# EasyEDA Pro project ProProject_STM32F1_TEMP_2024-12-15.epro

# Schematic Schematic1_1
Create Date: 2024-12-01; Page Name: P1; Project Name: STM32F1_TEMP; Schematic Name: Schematic1_1; Update Date: 2024-12-01; Company: 嘉立创EDA; Page Size: A4; Version: V1.0
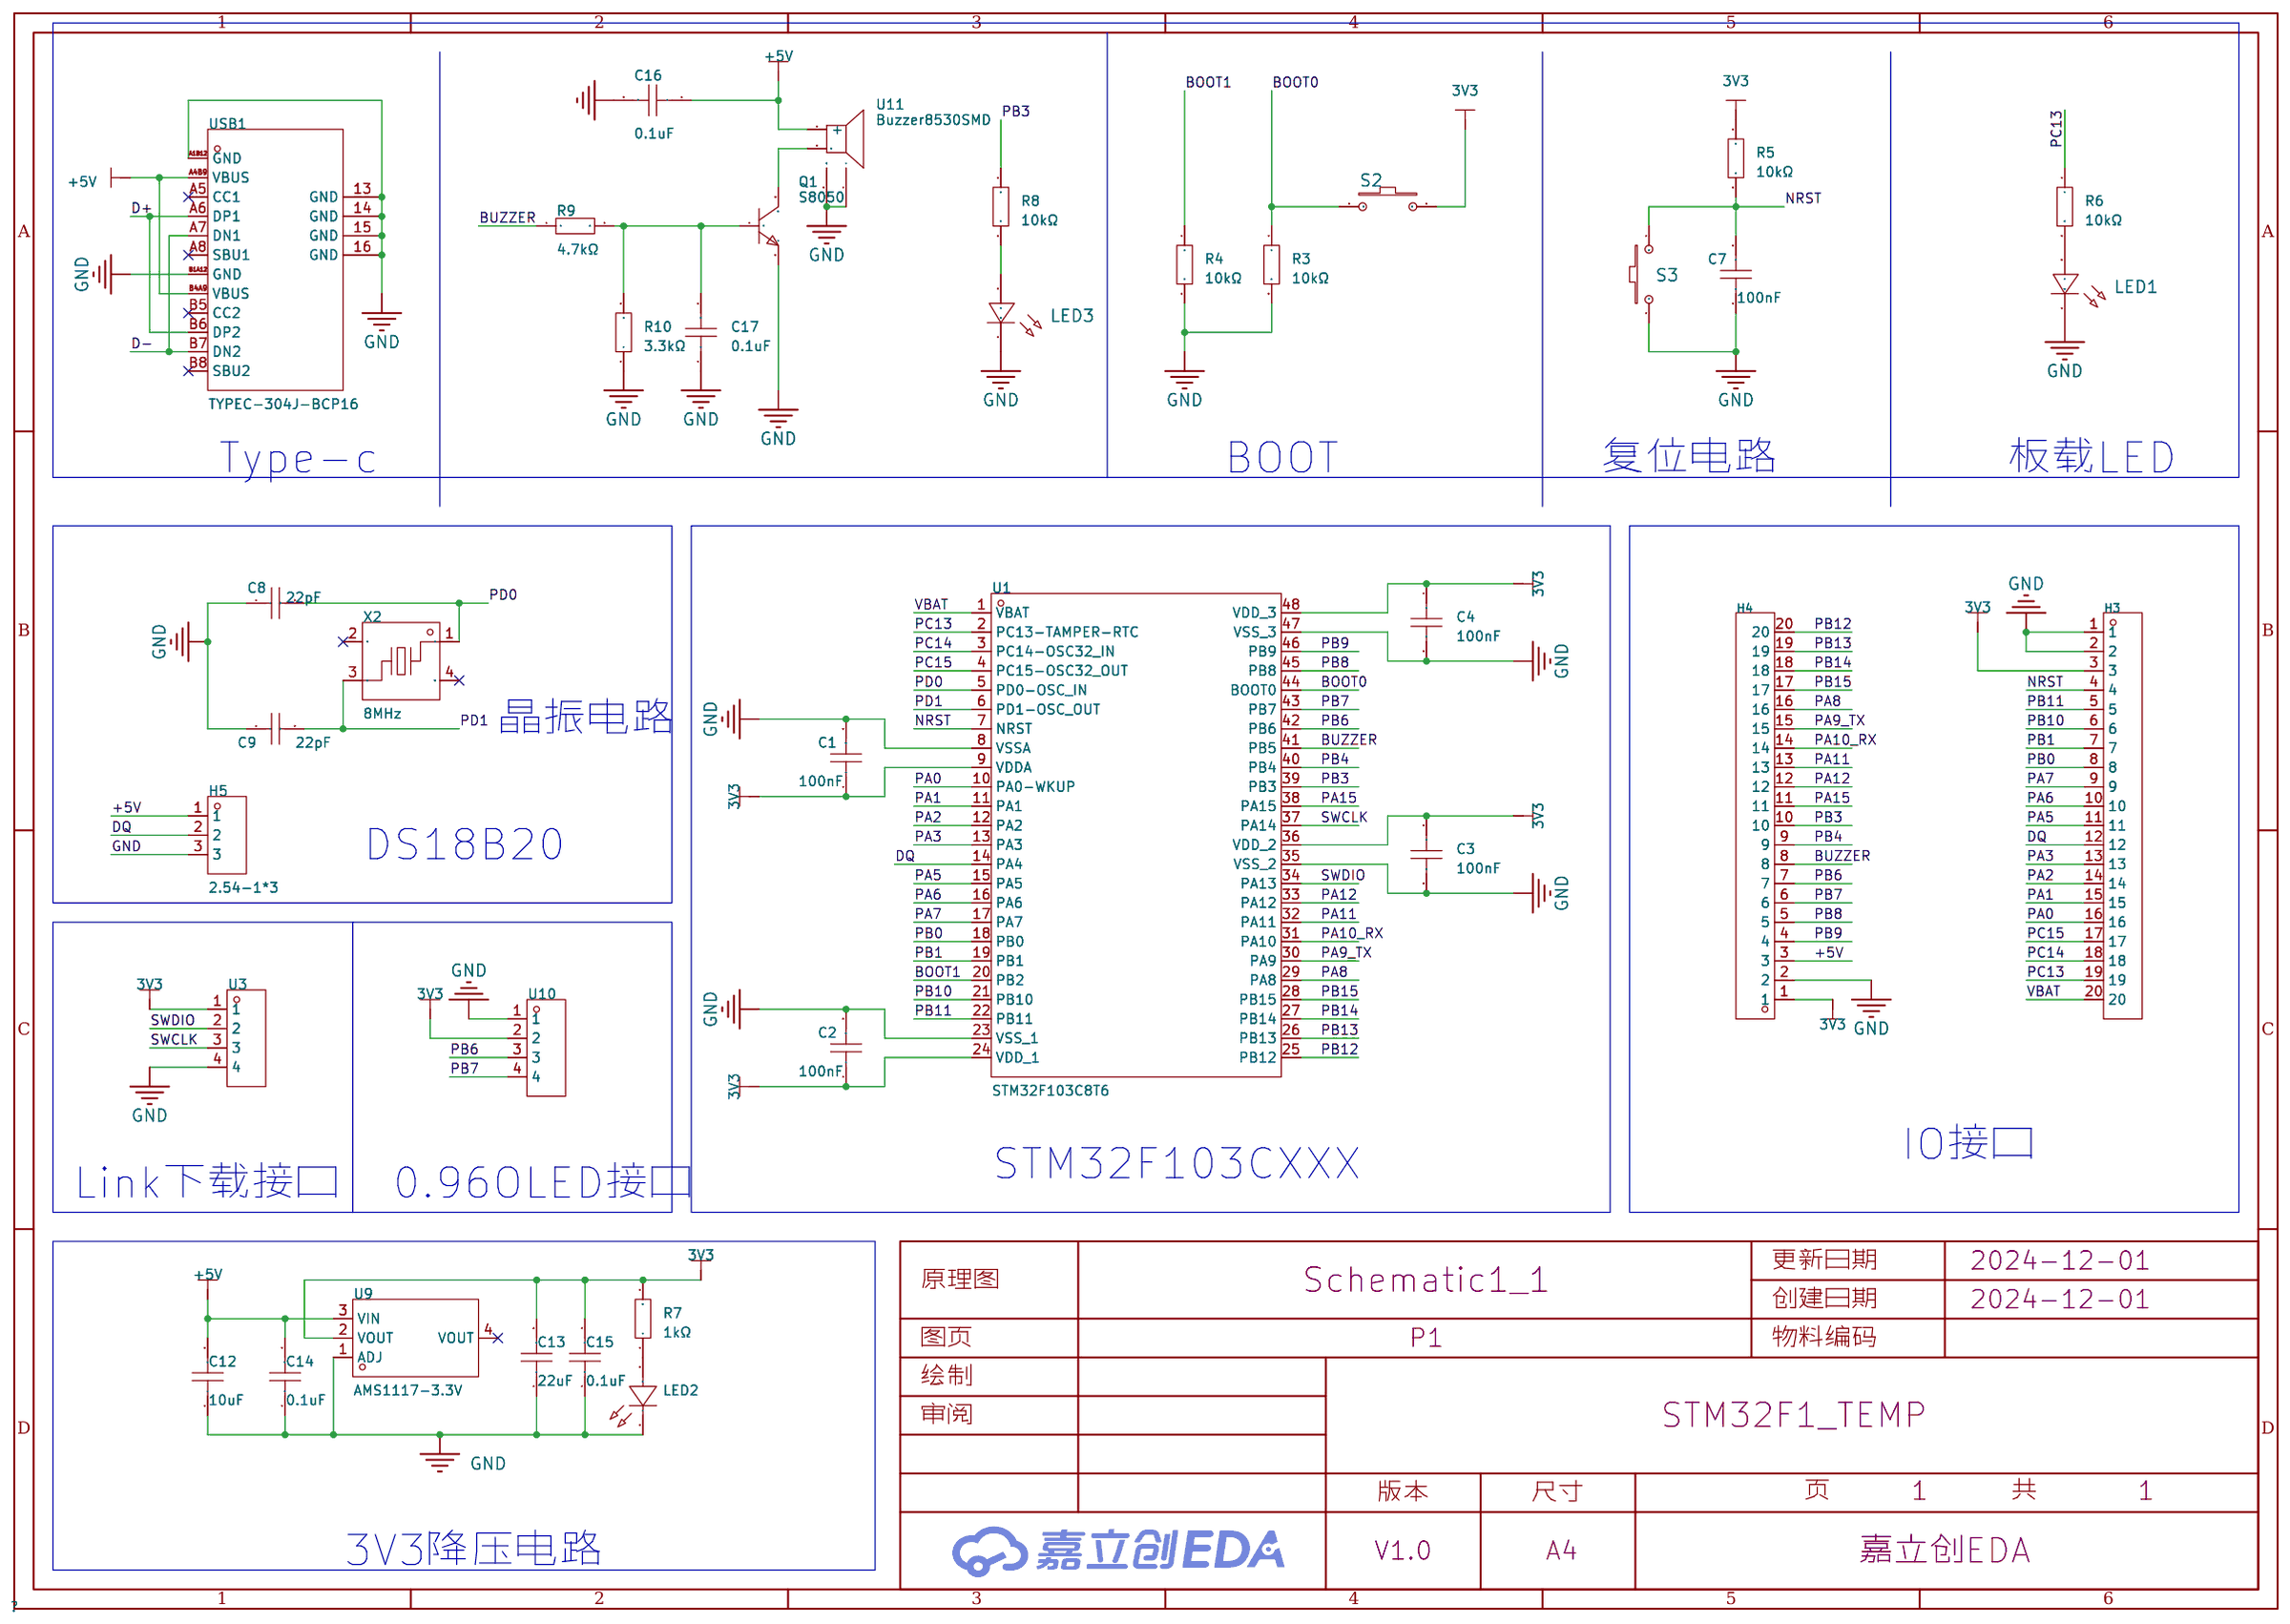
[diagram p0: schematic sheet]

## Parts
C1  100nF  [C0603]
C2  100nF  [C0603]
C3  100nF  [C0603]
C4  100nF  [C0603]
C7  100nF  [C0603]
C8  22pF  [C0603]
C9  22pF  [C0603]
C12  10uF  [C0603]
C13  22uF  [C0603]
C14  0.1uF  [C0603]
C15  0.1uF  [C0603]
C16  0.1uF  [C0603]
C17  0.1uF  [C0603]
H3  PZ254-1-20-Z-8.5  [HDR-TH_20P-P2.54-V-M]
H4  PZ254-1-20-Z-8.5  [HDR-TH_20P-P2.54-V-M]
H5  2.54-1*3  [HDR-TH_3P-P2.54-V-M-1]
LED1  -  [LED_0603]
LED2  -  [LED0805-RD_BLUE]
LED3  -  [LED_0603]
Q1  S8050  [SOT-23-3_L2.9-W1.3-P1.90-LS2.4-BR]
R3  10kΩ  [R0603]
R4  10kΩ  [R0603]
R5  10kΩ  [R0603]
R6  10kΩ  [R0603]
R7  1kΩ  [R0603]
R8  10kΩ  [R0603]
R9  4.7kΩ  [R0603]
R10  3.3kΩ  [R0603]
S2  按键-2Pin  [BUTTON_ALPS]
S3  按键-2Pin  [BUTTON_ALPS]
U1  STM32F103C8T6  [LQFP-48_L7.0-W7.0-P0.50-LS9.0-BL]
U3  XDZ254-1-04-Z-2.5-G1  [HDR-TH_4P-P2.54-V-M]
U9  AMS1117-3.3V  [SOT-223-4_L6.5-W3.5-P2.30-LS7.0-BR]
U10  XDZ254-1-04-Z-2.5-G1  [HDR-TH_4P-P2.54-V-M]
U11  Buzzer8530SMD  [BUZ-SMD_4P-L8.5-W8.5-P8.50-TL]
USB1  TYPEC-304J-BCP16  [USB-C-SMD_TYPEC-304J-BCP16]
X2  8MHz  [CRYSTAL-SMD_4P-L3.2-W2.5-BL]

## Library data of the parts
C1-C4 C7 = CC0603KRX7R9BB104: 容值:100nF;精度:±10%;额定电压:50V;材质(温度系数):X7R;; LCSC Part Name: 100nF ±10% 50V; Supplier Part: C14663; Manufacturer: YAGEO(国巨); Supplier Footprint: 0603; JLCPCB Part Class: 基础库; Datasheet: https://atta.szlcsc.com/upload/public/pdf/source/20180910/C282072_33301C7F631E79921B82A8DAC6BCC5B3.pdf; Supplier: LCSC; Tolerance: ±10%; Voltage Rated: 50V; Temperature Coefficient: X7R
C8 C9 = CC0603JRNPO9BN220: 容值:22pF;精度:±5%;额定电压:50V;材质(温度系数):NP0;; LCSC Part Name: 22pF ±5% 50V; Supplier Part: C105620; Manufacturer: YAGEO(国巨); Supplier Footprint: 0603; JLCPCB Part Class: 扩展库; Datasheet: https://atta.szlcsc.com/upload/public/pdf/source/20170505/1493957838062.pdf; Supplier: LCSC; Tolerance: ±5%; Voltage Rated: 50V; Temperature Coefficient: NP0
C12-C17 = CAP_0603: Supplier Footprint: 0603
H3 H4 = PZ254-1-20-Z-8.5_C2894943: 排数:单排;总PIN位数:20P;间距:2.54mm;插针结构:1x20P;行距:-;安装类型:直插;圆针/方针:方针;额定电流:3A;额定电压:-;配合针长度:6mm;塑高:2.5mm;端接针长度:3mm;触头材质:-;工作温度范围:-40℃~+105℃;颜色:黑色;; LCSC Part Name: 2.54mm 1x20P 直插 方针; Supplier Part: C2894943; Manufacturer: HCTL(华灿天禄); Supplier Footprint: 插件,P=2.54mm; JLCPCB Part Class: 扩展库; Datasheet: https://atta.szlcsc.com/upload/public/pdf/source/20230609/805D25CEF03592837AF6F506EEB5ED41.pdf; Supplier: LCSC; Number of Rows: 单排; Number of Pins: 20P; Pitch: 2.54mm; Pin Structure: 1x20P; Mounting Type: 直插; Circluar Pins/Square Pins: 方针; Current Rating (Max): 3A; Length of Mating Pin: 6mm; Insulation Height: 2.5mm; Length of End Connection Pin: 3mm; Operating Temperature Range: -40℃~+105℃; Color: 黑色
H5 = 2.54-1*3: 插针结构:1x3P;间距:2.54mm;排数:单排;总PIN位数:3P;触头镀层:金;; LCSC Part Name: 停产; Supplier Part: C5116482; Manufacturer: ZHOURI(洲日); Supplier Footprint: 插件,P=2.54mm; JLCPCB Part Class: 扩展库; Datasheet: https://atta.szlcsc.com/upload/public/pdf/source/20220729/4DB71EF9013296CFACD97372BAB8A1F0.pdf; Supplier: LCSC; Pin Structure: 1x3P; Pitch: 2.54mm; Number of Rows: 单排; Number of Pins: 3P; Contact Plating: 金
LED1 LED3 = LED_0603-R: Supplier Footprint: 0603
LED2 = RF-BGB170TS-CB-E0: 发光颜色:蓝灯;二极管配置:-;透镜颜色:-;主波长:-;峰值波长:-;色温:-;光通量(25时):-;测试电流:20mA;正向电压(VF):-;发光强度:-;功率:70mW;发光角度:140°;安装方式:正贴;工作温度:-40~+85;; LCSC Part Name: 蓝灯 正贴; Supplier Part: C2908306; Manufacturer: Refond(瑞丰); Supplier Footprint: 0805; JLCPCB Part Class: Extended Part; Datasheet: https://atta.szlcsc.com/upload/public/pdf/source/20211101/C871A18E9B6E101B84BDF0C661245F86.pdf; Supplier: LCSC; Emitted Color: 蓝灯; Forward Current: 20mA; Power Dissipation: 70mW; Viewing Angle: 140°; Mounting Sytle: 正贴; Operating Temperature: -40~+85
Q1 = S8050: NPN 25V 500mA 120-400 SOT-23; Supplier Part: C2931719; Manufacturer: Doeshare(德芯); Supplier Footprint: SOT-23; JLCPCB Part Class: 扩展库; Datasheet: https://atta.szlcsc.com/upload/public/pdf/source/20220117/E6D3315E0D6ADDB25840BFFAC039C5C0.pdf; Supplier: LCSC
R3-R6 R8 = 0603WAF1002T5E: 电阻类型:厚膜电阻;阻值:10kΩ;精度:±1%;功率:100mW;温度系数:±100ppm/;最大工作电压:75V;工作温度范围:-55~+155;; LCSC Part Name: 10kΩ ±1% 100mW; Supplier Part: C25804; Manufacturer: UNI-ROYAL(厚声); Supplier Footprint: 0603; JLCPCB Part Class: Basic Part; Datasheet: https://atta.szlcsc.com/upload/public/pdf/source/20200306/C422600_1E6D84923E4A46A82E41ADD87F860B5C.pdf; Supplier: LCSC; Type: 厚膜电阻; Tolerance: ±1%; Power(Watts): 100mW; Temperature Coefficient: ±100ppm/; Overload Voltage (Max): 75V; Operating Temperature Range: -55~+155
R7 = RS-05K102JT: 阻值:1kΩ;精度:±5%;功率:125mW;温度系数:±100ppm/;最大工作电压:150V;工作温度范围:-55~+155;; LCSC Part Name: 1kΩ ±5%; Supplier Part: C115302; Manufacturer: FH(风华); Supplier Footprint: 0805; JLCPCB Part Class: Extended Part; Datasheet: https://atta.szlcsc.com/upload/public/pdf/source/20170704/1499151304704.pdf; Supplier: LCSC; Tolerance: ±5%; Power(Watts): 125mW; Temperature Coefficient: ±100ppm/; Overload Voltage (Max): 150V; Operating Temperature Range: -55~+155
R9 = AECR0603F4K70K9: 电阻类型:厚膜电阻;阻值:4.7kΩ;精度:±1%;功率:100mW;最大工作电压:50V;温度系数:±100ppm/℃;; LCSC Part Name: 厚膜电阻 4.7kΩ ±1% 100mW; Supplier Part: C328364; Manufacturer: RESI(开步睿思); Supplier Footprint: 0603; JLCPCB Part Class: 扩展库; Datasheet: https://atta.szlcsc.com/upload/public/pdf/source/20181212/C352486_55819DC58ECB15BFA3B0F11121E3606D.pdf; Supplier: LCSC; Type: 厚膜电阻; Tolerance: ±1%; Power(Watts): 100mW; Overload Voltage (Max): 50V; Temperature Coefficient: ±100ppm/℃; Operating Temperature Range: -55℃~+155℃
R10 = 0603WAF3301T5E: 电阻类型:厚膜电阻;阻值:3.3kΩ;精度:±1%;功率:100mW;最大工作电压:75V;温度系数:±100ppm/℃;; LCSC Part Name: 3.3kΩ ±1% 100mW 厚膜电阻; Supplier Part: C22978; Manufacturer: UNI-ROYAL(厚声); Supplier Footprint: 0603; JLCPCB Part Class: 基础库; Datasheet: https://atta.szlcsc.com/upload/public/pdf/source/20200306/C422600_1E6D84923E4A46A82E41ADD87F860B5C.pdf; Supplier: LCSC; Type: 厚膜电阻; Tolerance: ±1%; Power(Watts): 100mW; Overload Voltage (Max): 75V; Temperature Coefficient: ±100ppm/℃; Operating Temperature Range: -55℃~+155℃
S2 S3 = 按键-2Pin: --Ƭ; Origin Footprint 2: SW-KEY1; LatestRevisionDate: 17-Jul-2002; LatestRevisionNote: Re-released for DXP Platform.; PackageReference: SPST-2; Published: 24-Mar-1999; Publisher: Altium Limited
U1 = STM32F103C8T6: CPU内核:ARM-M3;程序存储容量:64KB;RAM总容量:20KB;GPIO端口数量:37;工作电压范围:2V~3.6V;CPU最大主频:72MHz;程序存储器类型:FLASH;; Supplier Part: C8734; Manufacturer: ST(意法半导体); Supplier Footprint: LQFP-48(7x7); JLCPCB Part Class: 扩展库; Datasheet: https://atta.szlcsc.com/upload/public/pdf/source/20220812/8363ACEC51AD55ECEB84799464F7CB85.pdf; Supplier: LCSC; CPU Core: ARM-M3; Program Storage Size: 64KB; RAM Size: 20KB; GPIO Ports Number: 37; Operating Voltage Range: 2V~3.6V; CPU Maximum Speed: 72MHz; Program Memory Type: FLASH; Operating Temperature Range: -40℃~+85℃; ADC (Bit): 12bit; Universal Serial Bus: 有; Peripheral/Function: 看门狗；DMA；看门狗；温度传感器; Watchdog: 有; Infrared Data Association: 有; Low-Voltage Detect: 有; Direct Memory Access: 有; Internal Oscillator: 有
U3 U10 = XDZ254-1-04-Z-2.5-G1: 插针结构:1x4P;间距:2.54mm;圆针/方针:方针;安装类型:直插;排数:单排;总PIN位数:4P;额定电流:3A;配合针长度:6mm;塑高:2.5mm;端接针长度:3mm;工作温度范围:-40℃~+105℃;颜色:黑色;; LCSC Part Name: 间距:2.54mm 1x4P 直插 方针; Supplier Part: C18905845; Manufacturer: XUNDA(讯答); Supplier Footprint: 插件,P=2.54mm; Datasheet: https://atta.szlcsc.com/upload/public/pdf/source/20231019/B07AD669ED74A6E3E65E4CCF814A6B3E.pdf; Supplier: LCSC; Pin Structure: 1x4P; Pitch: 2.54mm; Circluar Pins/Square Pins: 方针; Mounting Type: 直插; Number of Rows: 单排; Number of Pins: 4P; Current Rating (Max): 3A; Length of Mating Pin: 6mm; Insulation Height: 2.5mm; Length of End Connection Pin: 3mm; Operating Temperature Range: -40℃~+105℃; Color: 黑色
U9 = REG1117A: Supplier Part: C2869046; Manufacturer: TI(德州仪器); Supplier Footprint: SOT-223-4; JLCPCB Part Class: Extended Part; Datasheet: https://atta.szlcsc.com/upload/public/pdf/source/20230221/F563D9394BFC1B9F42D11B54DC05EE53.pdf; Supplier: LCSC
U11 = Buzzer8530SMD: Supplier Part: C9900004191; Supplier Footprint: BuzzerMLT8530; JLCPCB Part Class: 扩展库; Supplier: LCSC
USB1 = TYPEC-304J-BCP16: 连接器类型:Type-C;标准:USB 3.1;公母:母;端口数量:1;触点数量:16P;安装方式:卧贴;额定电流 - 电源:5A;工作温度范围:-40℃~+85℃;焊接温度(最大值):260℃;; LCSC Part Name: Type-C 母 卧贴; Supplier Part: C2835315; Manufacturer: XUNPU(讯普); Supplier Footprint: SMD; JLCPCB Part Class: 扩展库; Datasheet: https://atta.szlcsc.com/upload/public/pdf/source/20210528/C2835315_A76BD3CF9329D12B6041421AD23BFD66.pdf; Supplier: LCSC; Connector Type: Type-C; Standard: USB 3.1; Gender: 母; Number of Ports: 1; Number of Contacts: 16P; Mounting Style: 卧贴; Current Rating - Power (Max): 5A; Operating Temperature Range: -40℃~+85℃; Soldering Temperature(Max): 260℃
X2 = X32258MSB4SI: 晶振类型:贴片晶振;频率:8MHz;常温频差:±10ppm;外接负载电容:20pF;频率稳定度(全温):±20ppm;; LCSC Part Name: 8MHz ±10ppm 20pF; Supplier Part: C2682774; Manufacturer: YXC(扬兴晶振); Supplier Footprint: SMD3225-4P; JLCPCB Part Class: 扩展库; Datasheet: https://atta.szlcsc.com/upload/public/pdf/source/20240329/19D5F850207469550BEB00D7DFEDBC7A.pdf; Supplier: LCSC; Crystal Type: 贴片晶振; Normal temperature Frequency Tolerance: ±10ppm; External load capacitor: 20pF; Frequency Stability(Full temperature range): ±20ppm; Operating Temperature: -40℃~+85℃

## Nets
3V3: C1.1 C2.1 C3.1 C4.1 C13.2 C15.2 H3.3 H4.1 R5.1 R7.2 S2.2 U1.9(VDDA) U1.24(VDD_1) U1.36(VDD_2) U1.48(VDD_3) U3.1 U9.2(VOUT) U10.2
+5V: C12.2 C14.2 C16.1 H4.3 H5.1 U9.3(VIN) U11.1(+) USB1.A4B9(VBUS) USB1.B4A9(VBUS)
GND: C1.2 C2.2 C3.2 C4.2 C7.1 C8.1 C9.1 C12.1 C13.1 C14.1 C15.1 C16.2 C17.1 H3.1 H3.2 H4.2 H5.3 LED1.1(C) LED2.1(K) LED3.1(C) Q1.2(E) R3.2 R4.2 R10.1 S3.1 U1.8(VSSA) U1.23(VSS_1) U1.35(VSS_2) U1.47(VSS_3) U3.4 U9.1(ADJ) U10.1 U11.3 U11.4 USB1.13(GND) USB1.14(GND) USB1.15(GND) USB1.16(GND) USB1.A1B12(GND) USB1.B1A12(GND)
VBAT: H3.20 U1.1(VBAT)
BOOT0: R3.1 S2.1 U1.44(BOOT0)
BOOT1: R4.1 U1.20(PB2)
BUZZER: H4.8 R9.1 U1.41(PB5)
D+: USB1.A6(DP1) USB1.B6(DP2)
D-: USB1.A7(DN1) USB1.B7(DN2)
DQ: H3.12 H5.2 U1.14(PA4)
NRST: C7.2 H3.4 R5.2 S3.2 U1.7(NRST)
PA0: H3.16 U1.10(PA0-WKUP)
PA1: H3.15 U1.11(PA1)
PA2: H3.14 U1.12(PA2)
PA3: H3.13 U1.13(PA3)
PA5: H3.11 U1.15(PA5)
PA6: H3.10 U1.16(PA6)
PA7: H3.9 U1.17(PA7)
PA8: H4.16 U1.29(PA8)
PA9_TX: H4.15 U1.30(PA9)
PA10_RX: H4.14 U1.31(PA10)
PA11: H4.13 U1.32(PA11)
PA12: H4.12 U1.33(PA12)
PA15: H4.11 U1.38(PA15)
PB0: H3.8 U1.18(PB0)
PB1: H3.7 U1.19(PB1)
PB3: H4.10 R8.1 U1.39(PB3)
PB4: H4.9 U1.40(PB4)
PB6: H4.7 U1.42(PB6) U10.3
PB7: H4.6 U1.43(PB7) U10.4
PB8: H4.5 U1.45(PB8)
PB9: H4.4 U1.46(PB9)
PB10: H3.6 U1.21(PB10)
PB11: H3.5 U1.22(PB11)
PB12: H4.20 U1.25(PB12)
PB13: H4.19 U1.26(PB13)
PB14: H4.18 U1.27(PB14)
PB15: H4.17 U1.28(PB15)
PC13: H3.19 R6.1 U1.2(PC13-TAMPER-RTC)
PC14: H3.18 U1.3(PC14-OSC32_IN)
PC15: H3.17 U1.4(PC15-OSC32_OUT)
PD0: C8.2 U1.5(PD0-OSC_IN) X2.1
PD1: C9.2 U1.6(PD1-OSC_OUT) X2.3
SWCLK: U1.37(PA14) U3.3
SWDIO: U1.34(PA13) U3.2
$1N2288: LED1.2(A) R6.2
$1N3114: LED2.2(A) R7.1
$1N7205: LED3.2(A) R8.2
$1N7342: Q1.3(C) U11.2
$1N7685: C17.2 Q1.1(B) R9.2 R10.2

Not connected (* = marked no-connect by the designer): U9 4(VOUT)*; USB1 A5(CC1)* A8(SBU1)* B5(CC2)* B8(SBU2)*; X2 2(GND)* 4(GND)*

## Notes on the sheet
- Type-c
- BOOT
- 复位电路
- 板载LED
- 晶振电路
- DS18B20
- IO接口
- STM32F103CXXX
- Link下载接口
- 0.96OLED接口
- 3V3降压电路

# Board PCB3
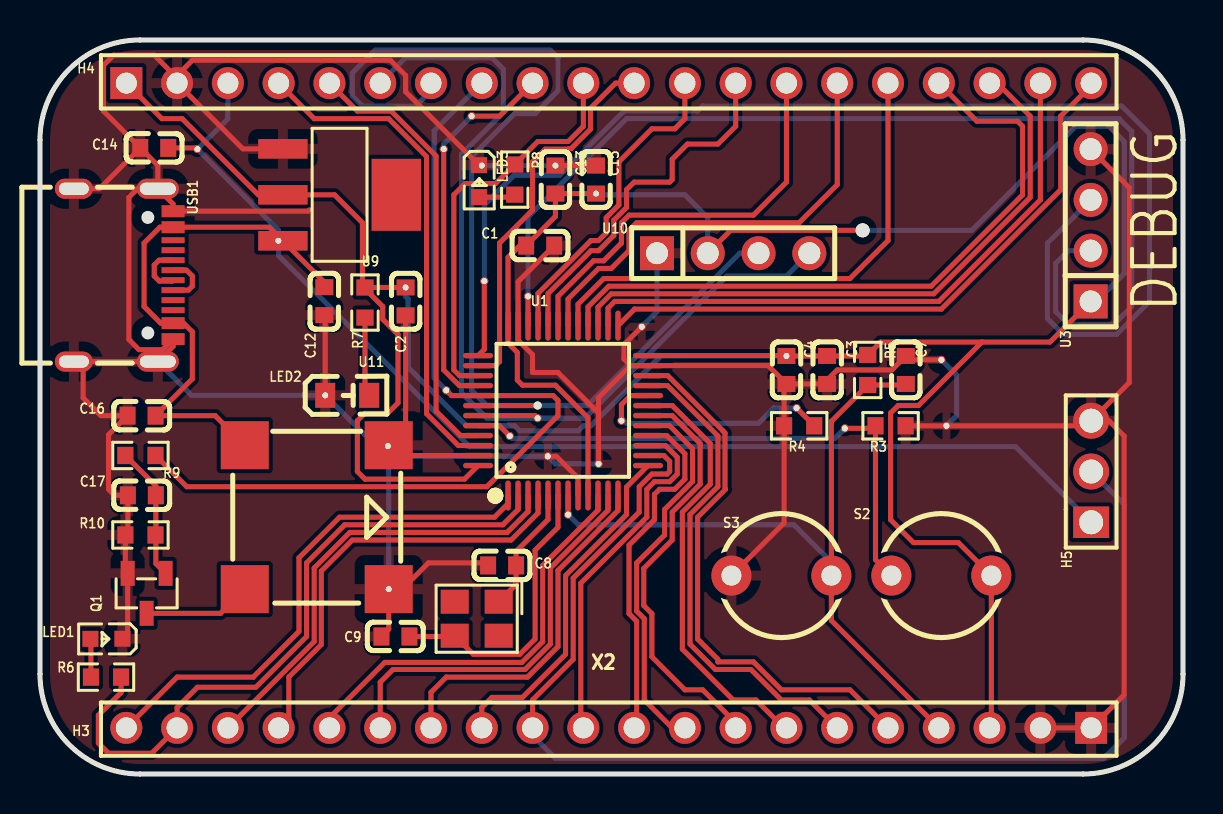
[diagram p1: board, top side]
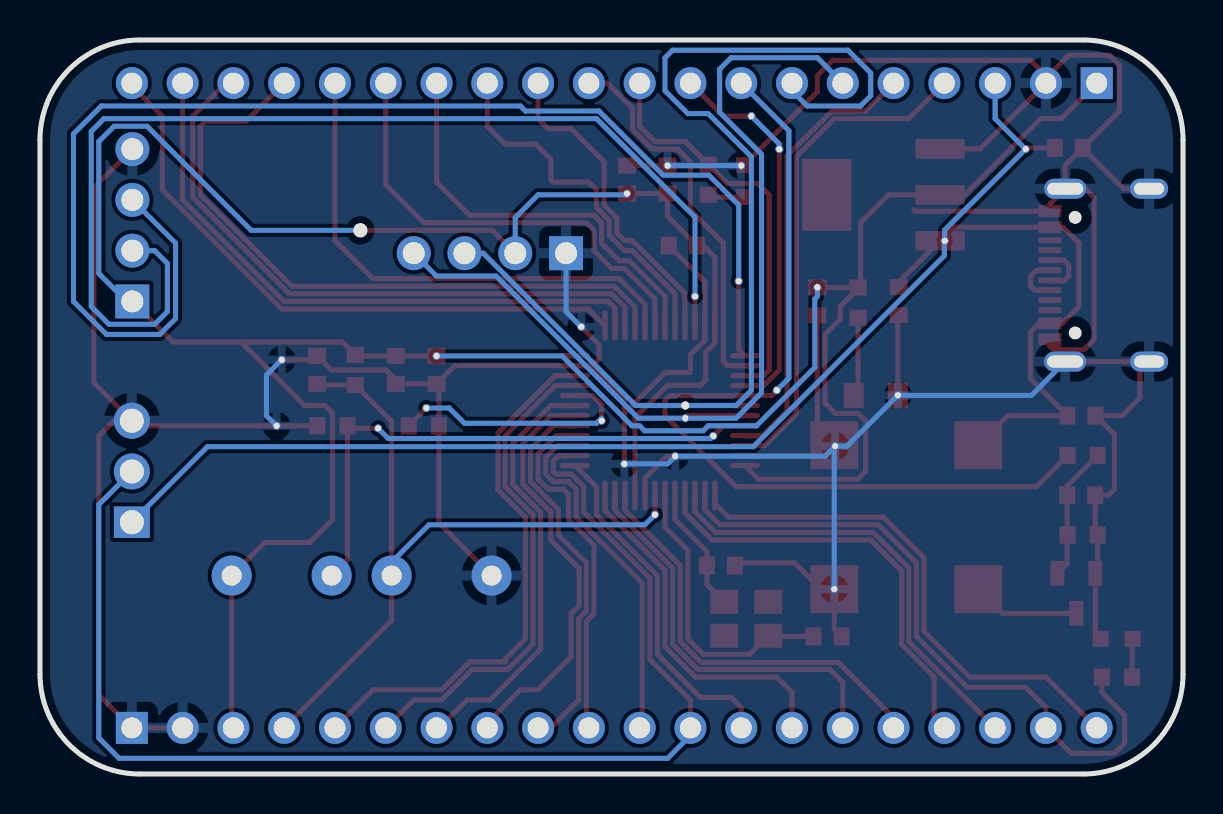
[diagram p2: board, bottom side, seen from below]

Outline 57.17 x 36.73 mm; copper layers: Top Layer, Bottom Layer. Coordinates in mm from the lower left corner of the outline.
Outline path: 0,31.73 0,5 arc(1.46,1.46) 5,0 52.17,0 arc(55.71,1.46) 57.17,5 57.17,31.73 arc(55.71,35.26) 52.17,36.73 5,36.73 arc(1.46,35.26) 0,31.73
Stack: Top Layer 0.035mm / Dielectric1 1.51mm FR4 er 4.5 / Bottom Layer 0.035mm

## Design rules (mm)
template: JLCPCB Capability(Two Layers Board)
spacing copperThickness1oz (default): track to track 0.102, other pairs 0.152 to 0.3
spacing copperThickness2oz: track to track 0.203, other pairs 0.152 to 0.3
track width copperThickness1oz (default): min 0.127, default 0.254, max 2.54
track width copperThickness2oz: min 0.203, default 0.254, max 2.54
differential pair differentialPair (default): width min 0.127, default 0.254, max 2.54; gap min 0.152, default 0.152
via viaSize (default): diameter min 0.5, default 0.61, max 10; hole min 0.3, default 0.305, max 6.3

## Placement (name value [footprint] x y rotation side)
C1  100nF  [C0603]  25.02 26.44 0 top
C2  100nF  [C0603]  18.29 23.64 270 top
C3  100nF  [C0603]  39.37 20.22 270 top
C4  100nF  [C0603]  37.34 20.22 270 top
C7  100nF  [C0603]  43.31 20.22 270 top
C8  22pF  [C0603]  23.11 10.44 0 top
C9  22pF  [C0603]  17.78 6.88 0 top
C12  10uF  [C0603]  14.22 23.66 90 top
C13  22uF  [C0603]  25.78 29.74 270 top
C14  0.1uF  [C0603]  5.72 31.33 0 top
C15  0.1uF  [C0603]  27.81 29.74 270 top
C16  0.1uF  [C0603]  5.08 17.93 180 top
C17  0.1uF  [C0603]  5.1 13.95 0 top
H3  PZ254-1-20-Z-8.5  [HDR-TH_20P-P2.54-V-M]  28.45 2.31 180 top
H4  PZ254-1-20-Z-8.5  [HDR-TH_20P-P2.54-V-M]  28.45 34.57 0 top
H5  2.54-1*3  [HDR-TH_3P-P2.54-V-M-1]  52.58 15.14 90 top
LED1  -  [LED_0603]  3.27 6.76 180 top
LED2  -  [LED0805-RD_BLUE]  15.37 18.95 0 top
LED3  -  [LED_0603]  21.97 29.61 270 top
NOREF  -  [Pad_e1435]  40.26 17.3 0 top
NOREF#2  -  [Pad_e1117]  14.27 18.95 0 top
NOREF#3  -  [Pad_e1087]  37.85 18.31 0 top
NOREF#4  -  [Pad_e1554]  27.81 29.04 0 top
NOREF#5  -  [Pad_e1383]  22.23 24.66 0 top
NOREF#6  -  [Pad_e1677]  45.08 20.72 0 top
NOREF#7  -  [Pad_e1017]  20.32 19.2 0 top
NOREF#8  -  [Pad_e1704]  37.34 20.92 0 top
NOREF#9  -  [Pad_e988]  24.89 18.44 0 top
NOREF#10  -  [Pad_e1078]  29.08 17.68 0 top
NOREF#11  -  [Pad_e1040]  26.42 12.98 0 top
NOREF#12  -  [Pad_e1534]  21.59 32.92 0 top
NOREF#13  -  [Pad_e992]  24.89 17.8 0 top
NOREF#14  -  [Pad_e1096]  30.1 22.38 0 top
NOREF#15  -  [Pad_e1530]  20.19 31.27 0 top
NOREF#16  -  [Pad_e1126]  25.4 15.9 0 top
NOREF#17  -  [Pad_e1396]  27.94 15.52 0 top
NOREF#18  -  [Pad_e1116]  17.4 16.41 0 top
NOREF#19  -  [Pad_e1204]  7.87 31.27 0 top
NOREF#20  -  [Pad_e950]  41.15 27.2 0 top
NOREF#21  -  [Pad_e1542]  22.1 30.44 0 top
NOREF#22  -  [Pad_e1770]  18.29 24.34 0 top
NOREF#23  -  [Pad_e1364]  17.44 9.25 0 top
NOREF#24  -  [Pad_e1186]  24.41 23.9 0 top
NOREF#25  -  [Pad_e1676]  45.34 17.42 0 top
NOREF#26  -  [Pad_e1466]  25.78 30.44 0 top
NOREF#27  -  [Pad_e1431]  23.49 16.91 0 top
NOREF#28  -  [Pad_e1152]  11.92 26.68 0 top
Q1  S8050  [SOT-23-3_L2.9-W1.3-P1.90-LS2.4-BR]  5.33 9.04 90 top
R3  10kΩ  [R0603]  42.55 17.42 0 top
R4  10kΩ  [R0603]  37.97 17.42 180 top
R5  10kΩ  [R0603]  41.4 20.22 270 top
R6  10kΩ  [R0603]  3.3 4.85 180 top
R7  1kΩ  [R0603]  16.26 23.59 90 top
R8  10kΩ  [R0603]  23.75 29.74 270 top
R9  4.7kΩ  [R0603]  5.02 15.94 180 top
R10  3.3kΩ  [R0603]  5.02 11.96 0 top
S2  按键-2Pin  [BUTTON_ALPS]  45.08 9.93 0 top
S3  按键-2Pin  [BUTTON_ALPS]  37.08 9.93 0 top
U1  STM32F103C8T6  [LQFP-48_L7.0-W7.0-P0.50-LS9.0-BL]  26.16 18.18 0 top
U3  XDZ254-1-04-Z-2.5-G1  [HDR-TH_4P-P2.54-V-M]  52.55 27.45 90 top
U9  AMS1117-3.3V  [SOT-223-4_L6.5-W3.5-P2.30-LS7.0-BR]  14.99 28.98 180 top
U10  XDZ254-1-04-Z-2.5-G1  [HDR-TH_4P-P2.54-V-M]  34.67 26.06 0 top
U11  Buzzer8530SMD  [BUZ-SMD_4P-L8.5-W8.5-P8.50-TL]  13.84 12.85 0 top
USB1  TYPEC-304J-BCP16  [USB-C-SMD_TYPEC-304J-BCP16]  4.18 24.96 270 top
X2  8MHz  [CRYSTAL-SMD_4P-L3.2-W2.5-BL]  21.84 7.77 180 top

## Footprints (pads in the part's own frame, mm; a bottom-side part is the same pattern mirrored in y, then rotated)
BUTTON_ALPS
  round 2 hole 1: 1(-2.5,0) 2(2.5,0)
BUZ-SMD_4P-L8.5-W8.5-P8.50-TL
  rect 2.4x2.4 smd: 1(-3.6,3.6) 2(-3.6,-3.6) 3(3.599,-3.599) 4(3.6,3.6)
C0603
  rect 0.8x0.9 smd: 1(-0.7,0) 2(0.7,0)
CRYSTAL-SMD_4P-L3.2-W2.5-BL
  rect 1.4x1.2 smd: 1(-1.1,-0.85) 2(1.1,-0.85) 3(1.1,0.85) 4(-1.1,0.85)
HDR-TH_3P-P2.54-V-M-1
  rect 1.575x1.8 hole 1.2: 1(-2.54,0)
  round 1.8 hole 1.2: 2(0,0) 3(2.54,0)
HDR-TH_4P-P2.54-V-M
  rect 1.7x1.7 hole 1.1: 1(-3.81,0)
  round 1.7 hole 1.1: 2(-1.27,0) 3(1.27,0) 4(3.81,0)
HDR-TH_20P-P2.54-V-M
  rect 1.6x1.6 hole 1.05: 1(-24.13,0)
  round 1.6 hole 1.05: 2(-21.59,0) 3(-19.05,0) 4(-16.51,0) 5(-13.97,0) 6(-11.43,0) 7(-8.89,0) 8(-6.35,0) 9(-3.81,0) 10(-1.27,0) 11(1.27,0) 12(3.81,0) 13(6.35,0) 14(8.89,0) 15(11.43,0) 16(13.97,0) 17(16.51,0) 18(19.05,0) 19(21.59,0) 20(24.13,0)
LED0805-RD_BLUE
  rect 1.001x1.25 smd: 1(-1.1,0) 2(1.1,0)
LED_0603
  rect 0.8x0.8 smd: 1(-0.851,-0.01) 2(0.75,-0.005)
LQFP-48_L7.0-W7.0-P0.50-LS9.0-BL
  oval 0.27x1.5 smd: 1(-2.75,-4.25) 2(-2.25,-4.25) 3(-1.75,-4.25) 4(-1.25,-4.25) 5(-0.75,-4.25) 6(-0.25,-4.25) 7(0.25,-4.25) 8(0.75,-4.25) 9(1.25,-4.25) 10(1.75,-4.25) 11(2.25,-4.25) 12(2.75,-4.25) 25(2.75,4.25) 26(2.25,4.25) 27(1.75,4.25) 28(1.25,4.25) 29(0.75,4.25) 30(0.25,4.25) 31(-0.25,4.25) 32(-0.75,4.25) 33(-1.25,4.25) 34(-1.75,4.25) 35(-2.25,4.25) 36(-2.75,4.25)
  oval 1.5x0.27 smd: 13(4.25,-2.75) 14(4.25,-2.25) 15(4.25,-1.75) 16(4.25,-1.25) 17(4.25,-0.75) 18(4.25,-0.25) 19(4.25,0.25) 20(4.25,0.75) 21(4.25,1.25) 22(4.25,1.75) 23(4.25,2.25) 24(4.25,2.75) 37(-4.25,2.75) 38(-4.25,2.25) 39(-4.25,1.75) 40(-4.25,1.25) 41(-4.25,0.75) 42(-4.25,0.25) 43(-4.25,-0.25) 44(-4.25,-0.75) 45(-4.25,-1.25) 46(-4.25,-1.75) 47(-4.25,-2.25) 48(-4.25,-2.75)
Pad_e950
  round 0.7 hole 0.914x0.3: 49(0,0)
Pad_e988
  round 0.4 hole 0.6x0.2: 49(0,0)
Pad_e992
  round 0.4 hole 0.3x0.2: 49(0,0)
Pad_e1017
  round 0.4 hole 0.3x0.2: 49(0,0)
Pad_e1040
  round 0.4 hole 0.3x0.2: 49(0,0)
Pad_e1078
  round 0.4 hole 0.3x0.2: 49(0,0)
Pad_e1087
  round 0.4 hole 0.3x0.2: 49(0,0)
Pad_e1096
  round 0.4 hole 0.3x0.2: 49(0,0)
Pad_e1116
  round 0.4 hole 0.3x0.2: 49(0,0)
Pad_e1117
  round 0.4 hole 0.3x0.2: 49(0,0)
Pad_e1126
  round 0.4 hole 0.3x0.2: 49(0,0)
Pad_e1152
  round 0.4 hole 0.3x0.2: 49(0,0)
Pad_e1186
  round 0.4 hole 0.3x0.2: 49(0,0)
Pad_e1204
  round 0.4 hole 0.3x0.2: 49(0,0)
Pad_e1364
  round 0.4 hole 0.3x0.2: 49(0,0)
Pad_e1383
  round 0.4 hole 0.3x0.2: 49(0,0)
Pad_e1396
  round 0.4 hole 0.3x0.2: 49(0,0)
Pad_e1431
  round 0.4 hole 0.3x0.2: 49(0,0)
Pad_e1435
  round 0.4 hole 0.3x0.2: 49(0,0)
Pad_e1466
  round 0.4 hole 0.3x0.2: 49(0,0)
Pad_e1530
  round 0.4 hole 0.3x0.2: 49(0,0)
Pad_e1534
  round 0.4 hole 0.3x0.2: 49(0,0)
Pad_e1542
  round 0.4 hole 0.3x0.2: 49(0,0)
Pad_e1554
  round 0.4 hole 0.3x0.2: 49(0,0)
Pad_e1676
  round 0.4 hole 0.3x0.2: 49(0,0)
Pad_e1677
  round 0.4 hole 0.3x0.2: 49(0,0)
Pad_e1704
  round 0.4 hole 0.3x0.2: 49(0,0)
Pad_e1770
  round 0.4 hole 0.3x0.2: 49(0,0)
R0603
  rect 0.806x0.864 smd: 1(-0.753,0) 2(0.753,0)
SOT-23-3_L2.9-W1.3-P1.90-LS2.4-BR
  rect 1.25x0.7 smd: 1(1,-0.95) 2(1,0.95) 3(-1,0)
SOT-223-4_L6.5-W3.5-P2.30-LS7.0-BR
  rect 2.47x0.98 smd: 1(2.835,-2.3) 2(2.835,0) 3(2.835,2.3)
  rect 2.47x3.6 smd: 4(-2.835,0)
USB-C-SMD_TYPEC-304J-BCP16
  oval 1x2.1 hole 0.6x1.8: 13(-4.325,1.718) 14(4.325,1.718)
  oval 1x1.9 hole 0.6x1.5: 15(-4.325,-2.482) 16(4.325,-2.482)
  rect 0.6x1.15 smd: A1B12(-3.2,2.482) A4B9(-2.4,2.482) B1A12(3.2,2.482) B4A9(2.4,2.482)
  rect 0.3x1.15 smd: A5(-1.25,2.482) A6(-0.25,2.482) A7(0.25,2.482) A8(1.25,2.482) B5(1.75,2.482) B6(0.75,2.482) B7(-0.75,2.482) B8(-1.75,2.482)

## Nets
3V3: C1.1 C2.1 C3.1 C4.1 C13.2 C15.2 H3.3 H4.1 NOREF#4.49 NOREF#8.49 NOREF#20.49 NOREF#22.49 R5.1 R7.2 S2.2 U1.9 U1.24 U1.36 U1.48 U3.1 U9.2 U10.2
+5V: C12.2 C14.2 C16.1 H4.3 H5.1 NOREF#19.49 NOREF#28.49 U9.3 U11.1 USB1.A4B9 USB1.B4A9
GND: C1.2 C2.2 C3.2 C4.2 C7.1 C8.1 C9.1 C12.1 C13.1 C14.1 C15.1 C16.2 C17.1 H3.1 H3.2 H4.2 H5.3 LED1.1 LED2.1 LED3.1 NOREF#2.49 NOREF#6.49 NOREF#14.49 NOREF#16.49 NOREF#17.49 NOREF#18.49 NOREF#21.49 NOREF#23.49 NOREF#25.49 NOREF#26.49 Q1.2 R3.2 R4.2 R10.1 S3.1 U1.8 U1.23 U1.35 U1.47 U3.4 U9.1 U10.1 U11.3 U11.4 USB1.13 USB1.14 USB1.15 USB1.16 USB1.A1B12 USB1.B1A12
VBAT: H3.20 U1.1
BOOT0: NOREF.49 NOREF#27.49 R3.1 S2.1 U1.44
BOOT1: NOREF#3.49 NOREF#10.49 R4.1 U1.20
BUZZER: H4.8 NOREF#7.49 R9.1 U1.41
D+: USB1.A6 USB1.B6
D-: USB1.A7 USB1.B7
DQ: H3.12 H5.2 U1.14
NRST: C7.2 H3.4 NOREF#11.49 R5.2 S3.2 U1.7
PA0: H3.16 U1.10
PA1: H3.15 U1.11
PA2: H3.14 U1.12
PA3: H3.13 U1.13
PA5: H3.11 U1.15
PA6: H3.10 U1.16
PA7: H3.9 U1.17
PA8: H4.16 U1.29
PA9_TX: H4.15 U1.30
PA10_RX: H4.14 U1.31
PA11: H4.13 U1.32
PA12: H4.12 U1.33
PA15: H4.11 U1.38
PB0: H3.8 U1.18
PB1: H3.7 U1.19
PB3: H4.10 R8.1 U1.39
PB4: H4.9 NOREF#12.49 NOREF#15.49 U1.40
PB6: H4.7 NOREF#9.49 U1.42 U10.3
PB7: H4.6 NOREF#13.49 U1.43 U10.4
PB8: H4.5 U1.45
PB9: H4.4 U1.46
PB10: H3.6 U1.21
PB11: H3.5 U1.22
PB12: H4.20 U1.25
PB13: H4.19 U1.26
PB14: H4.18 U1.27
PB15: H4.17 U1.28
PC13: H3.19 R6.1 U1.2
PC14: H3.18 U1.3
PC15: H3.17 U1.4
PD0: C8.2 U1.5 X2.1
PD1: C9.2 U1.6 X2.3
SWCLK: NOREF#5.49 U1.37 U3.3
SWDIO: NOREF#24.49 U1.34 U3.2
$1N2288: LED1.2 R6.2
$1N3114: LED2.2 R7.1
$1N7205: LED3.2 R8.2
$1N7342: Q1.3 U11.2
$1N7685: C17.2 Q1.1 R9.2 R10.2

Pads without a net: U9 4; USB1 A5 A8 B5 B8; X2 2 4

## Routing (per net, layer and track width the routed paths; a pad name or vN(x,y) marks a point on that pad's centre or on a via; arc(x,y) is an arc through that point)
3V3: length 173.7
  Top Layer w0.254: 16.26,24.34 18.29,24.34 NOREF#22.49 ; 16.26,24.34 16.13,24.47 16.13,27.58 14.73,28.98 U9.2 10.92,28.98 7.11,32.79 6.1,32.79 H4.1 ; 16.26,24.34 16.26,24.28 17.14,23.39 17.14,22.76 17.91,21.99 17.91,18.56 17.38,18.04 16.24,18.04 15.88,17.68 15.88,15.14 16.26,14.75 21.23,14.75 U1.48 ; 47.12,21.61 42.05,21.61 R5.1 41.35,20.92 C3.1 NOREF#8.49 37.32,20.93 U1.24 ; 47.12,21.61 50.52,21.61 U3.1 ; 47.12,21.61 43.94,18.44 42.93,18.44 42.55,18.06 42.55,12.72 43.69,11.58 45.93,11.58 S2.2 47.58,2.4 H3.3 ; NOREF#4.49 C13.2 25.78,27.9 C1.1 24,26.44 23.41,25.85 U1.36 23.41,21.56 23.88,21.09 23.88,19.71 24.13,19.45 25.78,19.45 27.41,17.82 U1.9 ; U10.2 34.54,27.2 NOREF#20.49
  Bottom Layer w0.254: U3.1 52.83,23.64 54.23,25.04 54.23,31.65 53.47,32.41 51.82,32.41 46.61,27.2 NOREF#20.49 ; NOREF#4.49 27.88,28.98 32.26,28.98 33.4,27.84 U10.2 ; NOREF#8.49 31.05,20.92 27.56,17.42 27.18,17.42 26.92,17.17 24,17.17 23.75,17.42 21.34,17.42 18.42,20.34 18.42,23.77 18.29,23.9 NOREF#22.49
+5V: length 85.5
  Top Layer w0.254: C14.2 7.81,31.33 NOREF#19.49 ; C12.2 14.22,24.61 U9.3 11.47,27.36 6,27.36 5.21,26.57 5.21,23.39 6.04,22.56 7.18,22.56 7.62,22.12 7.62,19.77 C16.1 8.76,17.93 U11.1
  Bottom Layer w0.254: H5.1 48.8,16.38 21.49,16.38 11.94,25.93 11.94,26.66 NOREF#28.49 11.92,27.22 NOREF#19.49 9.4,32.79 H4.3
GND: length 246
  Top Layer w0.254: NOREF#6.49 43.5,20.72 C7.1 42.61,20.22 39.88,20.22 39.37,19.71 C3.2 C4.2 ; LED3.1 18.29,34.14 18.29,34.95 17.53,35.71 7.62,35.71 6.86,34.95 6.86,34.82 ; 6.86,34.82 H4.2 10.15,31.28 U9.1 ; 6.86,34.82 5.72,35.96 3.68,35.96 3.17,35.46 3.17,33.17 C14.1 ; H3.2 H3.1 54.23,3.96 54.23,16.91 53.47,17.68 H5.3 ; NOREF#16.49 25.83,15.9 26.91,14.81 U1.8 ; S3.1 37.22,12.56 R4.2 37.22,19.4 C4.2 ; NOREF#2.49 14.27,22.92 C12.1 ; C14.1 5.89,30.45 USB1.13 ; C14.1 2.97,29.28 USB1.15 ; 29.54,20.43 27.94,18.84 27.94,18.06 ; 29.54,20.43 U1.23 36.42,20.43 C4.2 ; 29.54,20.43 29.21,20.76 29.21,21.49 NOREF#14.49 ; H5.3 52.32,17.42 NOREF#25.49 R3.2 ; H5.3 54.48,19.58 54.48,29.33 U3.4 ; NOREF#26.49 C15.1 ; 13.47,28.22 13.4,28.16 6.66,28.16 6.66,28.52 USB1.13 ; NOREF#17.49 27.94,18.06 ; 27.94,18.06 25.91,20.09 24.64,20.09 24.64,20.98 23.91,21.7 U1.35 23.91,24.63 C1.2 ; USB1.13 4.88,29.28 4.45,28.85 4.45,21.74 4.95,21.23 6.13,21.23 6.66,21.76 6.66,21.4 USB1.14 USB1.16 2.16,20.17 2.16,18.82 3.05,17.93 C16.2 3.43,16.98 3.43,14.25 3.73,13.95 C17.1 4.4,12.09 R10.1 4.27,10.15 Q1.2 4.38,7.03 LED1.1 ; U1.47 17.96,15.93 U11.4 18.29,17.3 C2.2 ; C8.1 22.29,10.56 19.43,10.56 18.12,9.25 U11.3 17.44,7.24 C9.1
  Bottom Layer w0.254: 17.44,16.36 17.91,15.9 NOREF#16.49 25.78,15.52 NOREF#17.49 ; 17.44,16.36 U11.3 ; 17.44,16.36 NOREF#18.49 16.81,16.41 NOREF#2.49 7.58,18.95 USB1.14 ; NOREF#25.49 45.85,17.93 45.85,19.96 NOREF#6.49 ; NOREF#26.49 NOREF#21.49 ; U10.1 30.86,23.14 NOREF#14.49
VBAT: length 26.3
  Top Layer w0.254: H3.20 6.86,4.85 10.67,4.85 12.95,7.14 12.95,10.82 14.99,12.85 22.73,12.85 23.41,13.53 U1.1
BOOT0: length 28.2
  Top Layer w0.254: U1.44 22.98,17.43 NOREF#27.49 ; S2.1 41.79,10.72 R3.1 41.66,17.3 NOREF.49
  Bottom Layer w0.254: NOREF.49 39.75,16.79 23.62,16.79 NOREF#27.49
BOOT1: length 12.6
  Top Layer w0.254: 29.08,17.8 29.08,18.48 29.54,18.93 U1.20 ; NOREF#3.49 38.73,17.43 R4.1
  Bottom Layer w0.254: 29.08,17.8 29.34,17.55 35.94,17.55 36.7,18.31 NOREF#3.49
BUZZER: length 45.4
  Top Layer w0.254: NOREF#7.49 20.59,18.93 U1.41 25.67,18.93 25.91,18.69 25.91,17.93 22.35,14.37 7.34,14.37 R9.1
  Bottom Layer w0.254: H4.8 19.71,32.18 19.71,19.81 NOREF#7.49
D+: length 2.6
  Top Layer w0.254: 6.66,25.21 7.33,25.21 7.62,24.92 7.62,24.41 7.42,24.21 6.66,24.21
D-: length 2.7
  Top Layer w0.254: 6.66,24.71 6.61,24.66 5.97,24.66 5.72,24.92 5.72,25.47 5.95,25.71 6.66,25.71
DQ: length 62.7
  Top Layer w0.254: H3.12 24.64,3.71 26.67,5.74 26.67,9.8 29.97,13.1 29.97,14.37 30.61,15.01 31.37,15.01 31.5,15.14 31.5,15.64 31.21,15.93 U1.14
  Bottom Layer w0.254: H3.12 24.64,1.93 25.78,0.78 53.21,0.78 54.23,1.8 54.23,13.48 H5.2
NRST: length 37.8
  Top Layer w0.254: C7.2 43.25,19.46 R5.2 39.58,17.64 S3.2 39.58,7.68 H3.4 ; U1.7 26.41,12.98
  Bottom Layer w0.254: S3.2 39.58,10.6 37.72,12.47 26.92,12.47 NOREF#11.49
PA0: length 21.2
  Top Layer w0.254: H3.16 14.48,2.82 17.25,5.59 24.1,5.59 25.15,6.63 25.15,10.44 27.91,13.2 U1.10
PA1: length 20.2
  Top Layer w0.254: H3.15 17.02,4.59 17.65,5.23 24.26,5.23 25.53,6.5 25.53,10.31 28.41,13.19 U1.11
PA2: length 17.9
  Top Layer w0.254: U1.12 28.91,13.19 25.91,10.18 25.91,6.37 24.38,4.85 20.32,4.85 19.56,4.09 H3.14
PA3: length 17.5
  Top Layer w0.254: U1.13 29.34,14.36 29.34,12.98 26.29,9.93 26.29,5.99 24.13,3.83 22.61,3.83 22.1,3.33 H3.13
PA5: length 17.7
  Top Layer w0.254: H3.11 27.05,2.44 27.05,9.55 30.35,12.85 30.35,14.25 30.73,14.63 31.5,14.63 31.88,15.01 31.88,15.85 31.29,16.43 U1.15
PA6: length 17.8
  Top Layer w0.254: H3.10 29.85,2.44 29.85,7.64 29.46,8.02 29.46,11.45 30.73,12.72 30.73,13.99 30.99,14.25 31.75,14.25 32.26,14.75 32.26,16.03 31.35,16.93 U1.16
PA7: length 19.2
  Top Layer w0.254: H3.9 31.62,2.31 30.23,3.71 30.23,7.77 29.85,8.15 29.85,10.56 31.24,11.96 31.24,13.24 32.64,14.63 32.64,16.28 31.48,17.43 U1.17
PA8: length 25.8
  Top Layer w0.254: H4.16 42.42,26.69 40.51,24.79 28.19,24.79 26.91,23.51 U1.29
PA9_TX: length 22.8
  Top Layer w0.254: H4.15 39.88,29.49 37.97,27.58 29.85,27.58 29.46,27.2 29.46,26.19 28.58,25.3 27.94,25.3 26.41,23.77 U1.30
PA10_RX: length 20.8
  Top Layer w0.254: H4.14 37.34,29.61 35.69,27.96 29.46,27.96 29.08,27.58 29.08,26.57 28.19,25.68 27.69,25.68 25.91,23.9 U1.31
PA11: length 18.2
  Top Layer w0.254: U1.32 25.41,24.04 27.56,26.19 27.94,26.19 28.7,26.95 28.7,27.71 29.34,28.34 29.34,29.23 29.72,29.61 31.5,29.61 31.62,29.74 31.62,30.76 32.39,31.52 33.91,31.52 34.8,32.41 H4.13
PA12: length 16.1
  Top Layer w0.254: H4.12 32.26,32.79 31.75,32.28 30.61,32.28 28.96,30.63 28.96,28.47 28.32,27.84 28.32,27.07 27.94,26.69 27.56,26.69 24.91,24.05 U1.33
PA15: length 19.2
  Top Layer w0.254: H4.11 28.79,34.57 27.53,33.31 27.53,32.26 26.56,31.29 26.44,31.29 26.42,31.27 25.27,31.27 24.64,30.63 24.64,28.22 22.99,26.57 22.99,20.63 22.79,20.43 U1.38
PB0: length 21
  Top Layer w0.254: H3.8 34.8,2.56 33.15,4.21 32.26,4.21 30.61,5.86 30.61,8.02 30.2,8.43 30.2,10.28 31.62,11.71 31.62,13.1 33.02,14.5 33.02,16.53 31.62,17.93 U1.18
PB1: length 21.6
  Top Layer w0.254: H3.7 37.21,2.31 35.81,3.71 34.67,3.71 32.13,6.25 32.13,13.1 33.53,14.5 33.53,16.53 31.63,18.43 U1.19
PB3: length 20.1
  Top Layer w0.254: U1.39 20.98,19.93 20.7,20.22 20.7,28.98 21.27,29.54 22.79,29.54 23.74,30.49 R8.1 24.9,31.65 26.42,31.65 27.18,32.41 H4.10
PB4: length 19.1
  Top Layer w0.254: U1.40 20.98,19.43 20.19,20.22 NOREF#15.49 ; NOREF#12.49 22.99,32.92 H4.9
  Bottom Layer w0.254: NOREF#12.49 20.19,31.52 NOREF#15.49
PB6: length 56.7
  Top Layer w0.254: NOREF#9.49 24.89,18.43 U1.42
  Bottom Layer w0.254: H4.7 19.56,34.19 18.8,33.42 16.13,33.42 15.62,33.93 15.62,35.08 16.76,36.22 25.53,36.22 25.91,35.84 25.91,34.19 24.77,33.04 23.75,33.04 21.59,30.88 21.59,19.2 22.35,18.44 NOREF#9.49 27.38,18.44 35,26.06 U10.3
PB7: length 48.4
  Top Layer w0.254: NOREF#13.49 24.76,17.93 U1.43
  Bottom Layer w0.254: U10.4 37.34,24.92 34.36,24.92 27.25,17.8 NOREF#13.49 22.35,17.8 21.08,19.07 21.08,31.01 23.18,33.11 23.18,35.27 22.61,35.84 18.29,35.84 H4.6
PB8: length 22.2
  Top Layer w0.254: H4.5 15.88,33.17 17.56,33.17 19.81,30.92 19.81,18.16 21.04,16.93 U1.45
PB9: length 25
  Top Layer w0.254: U1.46 20.93,16.43 19.34,18.03 19.34,30.89 17.44,32.79 13.72,32.79 H4.4
PB10: length 24.6
  Top Layer w0.254: H3.6 38.48,3.71 37.08,3.71 35.56,5.23 33.78,5.23 32.51,6.5 32.51,12.98 33.91,14.38 33.91,16.91 31.39,19.43 U1.21
PB11: length 27.4
  Top Layer w0.254: H3.5 40.51,4.21 37.08,4.21 35.69,5.61 33.91,5.61 33.91,5.74 32.89,6.75 32.89,12.85 34.29,14.25 34.27,14.27 34.27,17.06 34.16,17.16 34.16,17.17 31.4,19.93 U1.22
PB12: length 30.9
  Top Layer w0.254: U1.25 29.74,23.26 45.08,23.26 51.05,29.23 51.05,32.92 52.58,34.44 H4.20
PB13: length 30.6
  Top Layer w0.254: U1.26 28.41,23.31 28.75,23.64 44.96,23.64 50.04,28.72 H4.19
PB14: length 31.6
  Top Layer w0.254: U1.27 27.91,23.36 28.58,24.03 44.7,24.03 49.53,28.85 49.53,32.92 47.88,34.57 H4.18
PB15: length 33.5
  Top Layer w0.254: U1.28 27.41,23.37 28.45,24.41 44.58,24.41 49.15,28.98 49.15,32.41 48.89,32.66 46.86,32.66 H4.17
PC13: length 33.5
  Top Layer w0.254: R6.1 4.06,4.08 2.92,2.94 2.92,1.55 3.43,1.04 5.59,1.04 H3.19 6.86,3.33 7.87,4.34 10.8,4.34 13.33,6.88 13.33,10.56 15.24,12.47 23.15,12.47 23.91,13.23 U1.2
PC14: length 22.5
  Top Layer w0.254: H3.18 13.72,6.63 13.72,10.31 15.49,12.09 23.37,12.09 24.41,13.13 U1.3
PC15: length 21.7
  Top Layer w0.254: U1.4 24.91,13.06 23.56,11.71 15.62,11.71 14.07,10.16 14.07,6.48 12.45,4.85 12.45,2.82 H3.17
PD0: length 6.3
  Top Layer w0.254: X2.1 23.81,9.49 C8.2 23.81,11.14 25.41,12.73 U1.5
PD1: length 14.7
  Top Layer w0.254: U1.6 25.91,13.93 25.91,12.34 24.77,11.2 24.77,6.75 24,5.99 21.67,5.99 X2.3 20.7,6.88 C9.2
SWCLK: length 64.9
  Top Layer w0.254: U1.37 22.23,21.25 NOREF#5.49
  Bottom Layer w0.254: NOREF#5.49 22.23,28.47 23.72,29.96 26,29.96 29.21,33.17 32.89,33.17 33.15,33.42 54.1,33.42 55.5,32.03 55.5,23.64 53.85,21.99 51.18,21.99 50.39,22.78 50.39,26.56 U3.3
SWDIO: length 55.6
  Top Layer w0.254: U1.34 NOREF#24.49
  Bottom Layer w0.254: U3.2 51.43,26.19 50.8,25.55 50.8,23.14 51.43,22.5 53.72,22.5 54.61,23.39 54.61,32.15 53.98,32.79 29.34,32.79 24.41,27.86 NOREF#24.49
$1N2288: length 1.9
  Top Layer w0.254: R6.2 2.55,6.74 LED1.2
$1N3114: length 4
  Top Layer w0.254: LED2.2 16.26,19.16 R7.1
$1N7205: length 1.8
  Top Layer w0.254: LED3.2 23.63,28.86 R8.2
$1N7342: length 5.4
  Top Layer w0.254: Q1.3 9.03,8.04 U11.2
$1N7685: length 6.8
  Top Layer w0.254: 5.8,11.98 R10.2 ; 5.8,11.98 C17.2 5.8,14.41 R9.2 ; 5.8,11.98 5.8,10.53 Q1.1

## Copper pours and planes (outline as drawn; the poured copper is in the pictures)
GND on Top Layer: -1.65,38.38 58.04,38.38 58.04,-1.37 -1.65,-1.37
GND on Bottom Layer: -1.65,38.12 58.8,38.12 58.8,-2.01 -1.65,-2.01

## Text on the board
Top Silkscreen Layer: DEBUG
